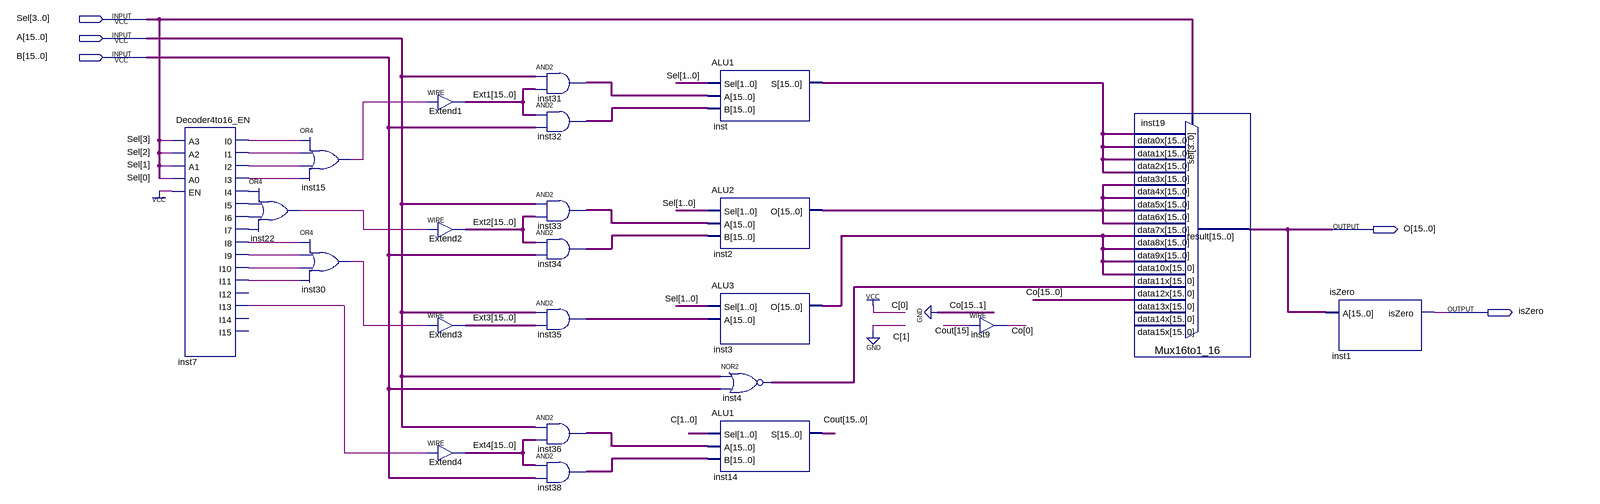
[diagram p0: schematic sheet]
// Quartus schematic ALU.bdf as structural Verilog: 23 symbols, 5 pins
module ALU (
  input  [3:0] Sel,
  input  [15:0] A,
  input  [15:0] B,
  output [15:0] O,
  output isZero
);

  wire inst7_i0, inst7_i1, inst7_i2, inst7_i3, inst7_i4, inst7_i5, inst7_i6, inst7_i7, inst7_i8, inst7_i9,
       inst7_i10, inst7_i11, inst7_i13, inst15_out, inst22_out, inst30_out;
  wire [0:0] Co;
  wire [15:0] Cout, Ext1, Ext2, Ext3, Ext4, inst2_o, inst3_o, inst4_out, inst31_out, inst32_out, inst33_out,
       inst34_out, inst35_out, inst36_out, inst38_out, inst_s;

  Decoder4to16_EN inst7 (
    .A3(Sel[3]), .A2(Sel[2]), .A1(Sel[1]), .A0(Sel[0]), .EN(1'b1), .I0(inst7_i0), .I1(inst7_i1),
    .I2(inst7_i2), .I3(inst7_i3), .I4(inst7_i4), .I5(inst7_i5), .I6(inst7_i6), .I7(inst7_i7), .I8(inst7_i8),
    .I9(inst7_i9), .I10(inst7_i10), .I11(inst7_i11), .I13(inst7_i13));  // open: I12, I14, I15
  or inst22 (inst22_out, inst7_i4, inst7_i5, inst7_i6, inst7_i7);
  or inst15 (inst15_out, inst7_i0, inst7_i1, inst7_i2, inst7_i3);
  or inst30 (inst30_out, inst7_i8, inst7_i9, inst7_i10, inst7_i11);
  assign Ext1 = {16{inst15_out}};  // WIRE Extend1
  assign Ext2 = {16{inst22_out}};  // WIRE Extend2
  assign Ext3 = {16{inst30_out}};  // WIRE Extend3
  assign Ext4 = {16{inst7_i13}};  // WIRE Extend4
  assign inst31_out = A & Ext1;  // AND2 inst31, 16 bits wide
  assign inst32_out = Ext1 & B;  // AND2 inst32, 16 bits wide
  assign inst33_out = A & Ext2;  // AND2 inst33, 16 bits wide
  assign inst34_out = Ext2 & B;  // AND2 inst34, 16 bits wide
  assign inst35_out = A & Ext3;  // AND2 inst35, 16 bits wide
  assign inst36_out = A & Ext4;  // AND2 inst36, 16 bits wide
  assign inst38_out = Ext4 & B;  // AND2 inst38, 16 bits wide
  ALU1 inst (.Sel(Sel[1:0]), .A(inst31_out), .B(inst32_out), .S(inst_s));
  ALU2 inst2 (.Sel(Sel[1:0]), .A(inst33_out), .B(inst34_out), .O(inst2_o));
  ALU3 inst3 (.Sel(Sel[1:0]), .A(inst35_out), .O(inst3_o));
  assign inst4_out = ~(A | B);  // NOR2 inst4, 16 bits wide
  ALU1 inst14 (.Sel(2'b01), .A(inst36_out), .B(inst38_out), .S(Cout));
  assign Co[0] = Cout[15];  // WIRE inst9
  Mux16to1_16 inst19 (
    .data13x({{15{1'b0}}, Co[0]}), .data12x(inst4_out), .data11x(inst3_o), .data10x(inst3_o),
    .data9x(inst3_o), .data8x(inst3_o), .data7x(inst2_o), .data6x(inst2_o), .data5x(inst2_o),
    .data4x(inst2_o), .data3x(inst_s), .data2x(inst_s), .data1x(inst_s), .data0x(inst_s), .sel(Sel),
    .result(O));  // open: data15x, data14x
  isZero inst1 (.A(O), .isZero(isZero));
endmodule
